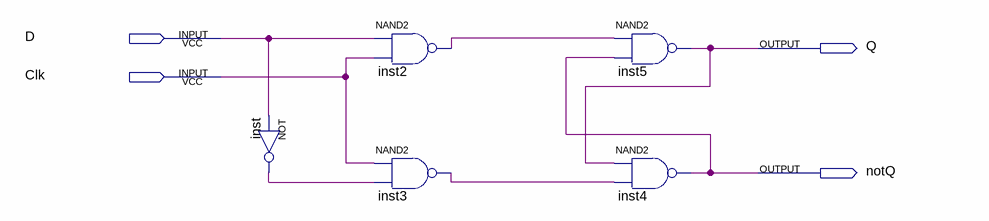
[diagram p0: schematic sheet]
// Quartus schematic d_latch.bdf as structural Verilog: 5 symbols, 4 pins
module d_latch (
  input  D,
  input  Clk,
  output Q,
  output notQ
);

  wire inst2_out, inst3_out, inst_out;

  not inst (inst_out, D);
  nand inst2 (inst2_out, D, Clk);
  nand inst3 (inst3_out, Clk, inst_out);
  nand inst5 (Q, inst2_out, notQ);
  nand inst4 (notQ, Q, inst3_out);
endmodule
